# Altium schematic sheet as14120_power.SchDoc
size A3; PageSetup: Record=PageOptions|CenterHorizontal=True|CenterVertical=True|PrintScale=3.75|XCorrection=1.00|YCorrection=1.00|PrintKind=0|BorderSize=5000000|LeftOffset=0|BottomOffset=0|Orientation=2|PaperLength=1000|PaperWidth=1000|Scale=100|PaperSource=7|PrintQuality=-4|MediaType=1|DitherType=10|PaperKind=A4 (210 x 297 мм)|PrintScaleMode=1
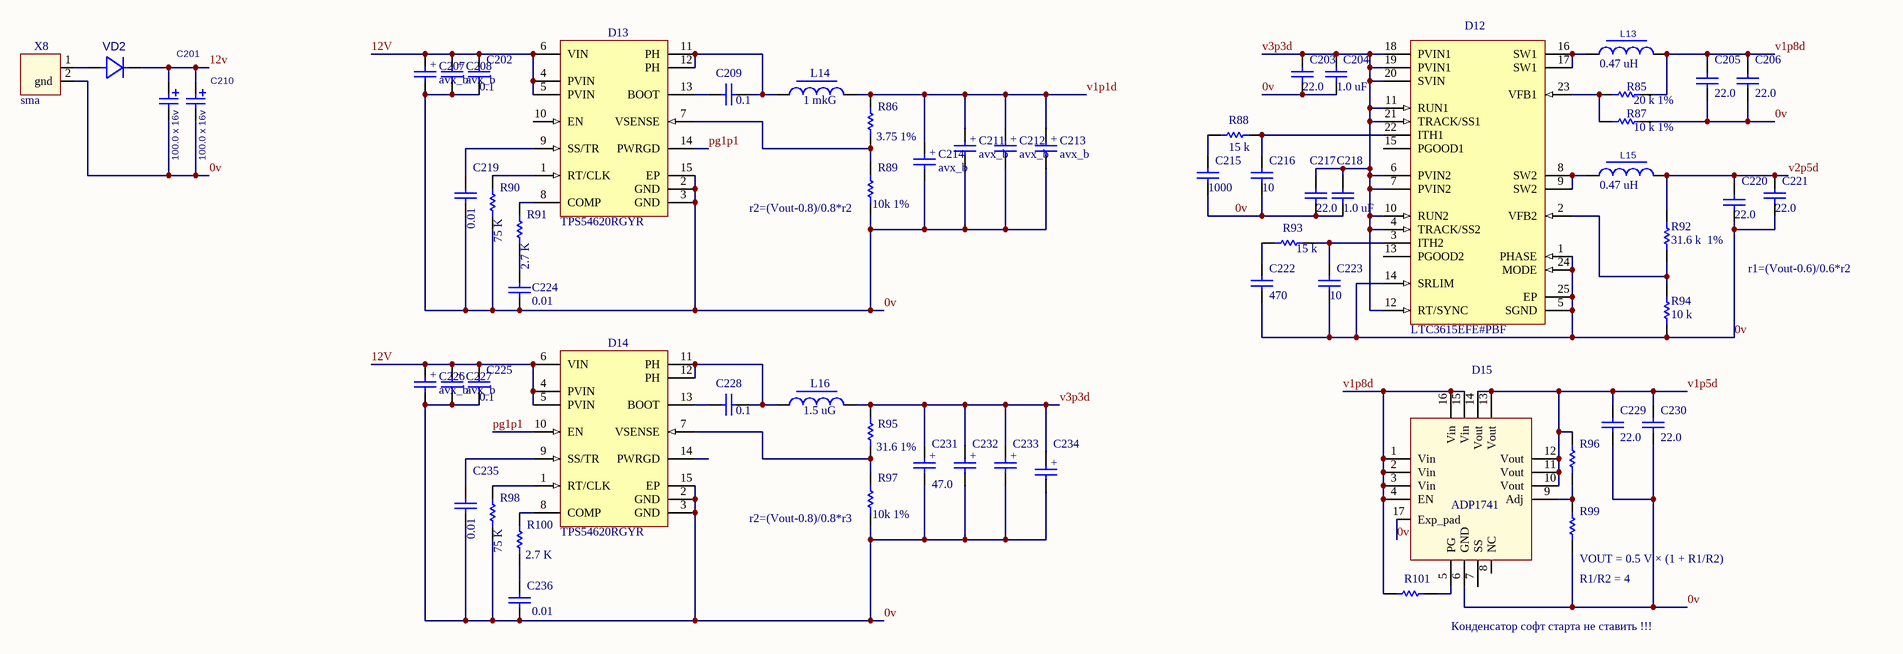
[diagram p0: as14120_power.SchDoc]

## Parts
C201  value 100.0 x 16v  [AVX_D]  (hidden comment: AVX_D)
C202  value 0.1  [CAPC0805(2012)100_N]  (hidden comment: CAP_0805)
C203  value 22.0  [CAPC0805(2012)100_N]  (hidden comment: CAP_0805)
C204  value 1.0 uF  [CAPC0805(2012)100_N]  (hidden comment: CAP_0805)
C205  value 22.0  [CAPC0805(2012)100_N]  (hidden comment: CAP_0805)
C206  value 22.0  [CAPC0805(2012)100_N]  (hidden comment: CAP_0805)
C207  avx_b  [avx_b]
C208  avx_b  [avx_b]
C209  value 0.1  [CAPC0805(2012)100_N]  (hidden comment: CAP_0805)
C210  value 100.0 x 16v  [AVX_D]  (hidden comment: AVX_D)
C211  avx_b  [avx_b]
C212  avx_b  [avx_b]
C213  avx_b  [avx_b]
C214  avx_b  [avx_b]
C215  value 1000  [CAPC0805(2012)100_N]  (hidden comment: CAP_0805)
C216  value 10  [CAPC0805(2012)100_N]  (hidden comment: CAP_0805)
C217  value 22.0  [CAPC0805(2012)100_N]  (hidden comment: CAP_0805)
C218  value 1.0 uF  [CAPC0805(2012)100_N]  (hidden comment: CAP_0805)
C219  value 0.01  [CAPC0805(2012)100_N]  (hidden comment: CAP_0805)
C220  value 22.0  [CAPC0805(2012)100_N]  (hidden comment: CAP_0805)
C221  value 22.0  [CAPC0805(2012)100_N]  (hidden comment: CAP_0805)
C222  value 470  [CAPC0805(2012)100_N]  (hidden comment: CAP_0805)
C223  value 10  [CAPC0805(2012)100_N]  (hidden comment: CAP_0805)
C224  value 0.01  [CAPC0805(2012)100_N]  (hidden comment: CAP_0805)
C225  value 0.1  [CAPC0805(2012)100_N]  (hidden comment: CAP_0805)
C226  avx_b  [avx_b]
C227  avx_b  [avx_b]
C228  value 0.1  [CAPC0805(2012)100_N]  (hidden comment: CAP_0805)
C229  value 22.0  [CAPC0805(2012)100_N]  (hidden comment: CAP_0805)
C230  value 22.0  [CAPC0805(2012)100_N]  (hidden comment: CAP_0805)
C231  value 47.0  [avx_b]  (hidden comment: avx_b)
C232  avx_b  [avx_b]  (value not drawn)
C233  avx_b  [avx_b]  (value not drawn)
C234  avx_b  [avx_b]  (value not drawn)
C235  value 0.01  [CAPC0805(2012)100_N]  (hidden comment: CAP_0805)
C236  value 0.01  [CAPC0805(2012)100_N]  (hidden comment: CAP_0805)
D12  LTC3615EFE#PBF  [LT-FE-24-EPV-AA_N]
D13  TPS54620RGYR  [RGY14-2050X2050TP]
D14  TPS54620RGYR  [RGY14-2050X2050TP]
D15  ADP1741  [CP-16-4_N]
L13  value 0.47 uH  [IND_Sumida_CDRH3D16]  (hidden comment: IND_Sumida_CDRH3D16)
L14  value 1 mkG  [IND_CDR127_Sumida]  (hidden comment: ind_cdr127_sumida)
L15  value 0.47 uH  [IND_Sumida_CDRH3D16]  (hidden comment: IND_Sumida_CDRH3D16)
L16  value 1.5 uG  [IND_CDR127_Sumida]  (hidden comment: ind_cdr127_sumida)
R85  value 20 k 1%  [RESC0805(2012)_L]  (hidden comment: 1K 1% 0805(2012))
R86  value 3.75 1%  [RESC0805(2012)_L]  (hidden comment: 1K 1% 0805(2012))
R87  value 10 k 1%  [RESC0805(2012)_L]  (hidden comment: 1K 1% 0805(2012))
R88  value 15 k  [RESC0805(2012)_L]  (hidden comment: 1K 1% 0805(2012))
R89  value 10k 1%  [RESC0805(2012)_L]  (hidden comment: 1K 1% 0805(2012))
R90  value 75 K  [RESC0805(2012)_L]  (hidden comment: 1K 1% 0805(2012))
R91  value 2.7 K  [RESC0805(2012)_L]  (hidden comment: 1K 1% 0805(2012))
R92  value 31.6 k  1%  [RESC0805(2012)_L]  (hidden comment: 1K 1% 0805(2012))
R93  value 15 k  [RESC0805(2012)_L]  (hidden comment: 1K 1% 0805(2012))
R94  value 10 k  [RESC0805(2012)_L]  (hidden comment: 1K 1% 0805(2012))
R95  value 31.6 1%  [RESC0805(2012)_L]  (hidden comment: 1K 1% 0805(2012))
R96  1K 1% 0805(2012)  [RESC0805(2012)_L]  (value not drawn)
R97  value 10k 1%  [RESC0805(2012)_L]  (hidden comment: 1K 1% 0805(2012))
R98  value 75 K  [RESC0805(2012)_L]  (hidden comment: 1K 1% 0805(2012))
R99  1K 1% 0805(2012)  [RESC0805(2012)_L]  (value not drawn)
R100  value 2.7 K  [RESC0805(2012)_L]  (hidden comment: 1K 1% 0805(2012))
R101  1K 5% 0603(1608)  [RESC0603(1608)_L]  (value not drawn)
VD2  30BQ60  [SMC]  (value not drawn)
X8  sma  [sma]

## Nets
0v: C201.2 C202.2 C203.1 C204.1 C205.1 C206.1 C207.2 C208.2 C210.2 C211.2 C212.2 C213.2 C214.2 C215.1 C216.1 C217.1 C218.1 C219.1 C220.1 C221.1 C222.1 C223.1 C224.1 C225.2 C226.2 C227.2 C229.1 C230.1 C231.2 C232.2 C233.2 C234.2 C235.1 C236.1 D12.1(PHASE) D12.5(SGND) D12.14(SRLIM) D12.24(MODE) D12.25(EP) D13.2(GND) D13.3(GND) D13.15(EP) D14.2(GND) D14.3(GND) D14.15(EP) D15.6(GND) D15.17(Exp_pad) R87.2 R89.1 R90.2 R94.1 R97.1 R98.2 R99.1 X8.2(gnd)
12V: C201.1 C202.1 C207.1 C208.1 C210.1 C225.1 C226.1 C227.1 D13.4(PVIN) D13.5(PVIN) D13.6(VIN) D14.4(PVIN) D14.5(PVIN) D14.6(VIN) VD2.1
pg1p1: D13.14(PWRGD) D14.10(EN)
v1p1d: C211.1 C212.1 C213.1 C214.1 L14.2 R86.2
v1p5d: C229.2 C230.2 D15.10(Vout) D15.11(Vout) D15.12(Vout) D15.13(Vout) D15.14(Vout) R96.2
v1p8d: C205.2 C206.2 D15.1(Vin) D15.2(Vin) D15.3(Vin) D15.4(EN) D15.15(Vin) D15.16(Vin) L13.2 R85.2 R101.2
v2p5d: C220.2 C221.2 L15.2 R92.2
v3p3d: C203.2 C204.2 C217.2 C218.2 C231.1 C232.1 C233.1 C234.1 D12.4(TRACK/SS2) D12.6(PVIN2) D12.7(PVIN2) D12.10(RUN2) D12.11(RUN1) D12.12(RT/SYNC) D12.18(PVIN1) D12.19(PVIN1) D12.20(SVIN) D12.21(TRACK/SS1) L16.2 R95.2
NetC209_1: C209.1 D13.13(BOOT)
NetC209_2: C209.2 D13.11(PH) D13.12(PH) L14.1
NetC215_2: C215.2 R88.1
NetC216_2: C216.2 D12.22(ITH1) R88.2
NetC219_2: C219.2 D13.9(SS/TR)
NetC222_2: C222.2 R93.1
NetC223_2: C223.2 D12.3(ITH2) R93.2
NetC224_2: C224.2 R91.2
NetC228_1: C228.1 D14.13(BOOT)
NetC228_2: C228.2 D14.11(PH) D14.12(PH) L16.1
NetC235_2: C235.2 D14.9(SS/TR)
NetC236_2: C236.2 R100.2
NetD12_2: D12.2(VFB2) R92.1 R94.2
NetD12_8: D12.8(SW2) D12.9(SW2) L15.1
NetD12_16: D12.16(SW1) D12.17(SW1) L13.1
NetD12_23: D12.23(VFB1) R85.1 R87.1
NetD13_1: D13.1(RT/CLK) R90.1
NetD13_7: D13.7(VSENSE) R86.1 R89.2
NetD13_8: D13.8(COMP) R91.1
NetD14_1: D14.1(RT/CLK) R98.1
NetD14_7: D14.7(VSENSE) R95.1 R97.2
NetD14_8: D14.8(COMP) R100.1
NetD15_5: D15.5(PG) R101.1
NetD15_9: D15.9(Adj) R96.1 R99.2
NetVD2_2: VD2.2 X8.1

Not connected (* = marked no-connect by the designer): D12 13(PGOOD2) 15(PGOOD1); D13 10(EN); D14 14(PWRGD); D15 7(SS) 8(NC)

## Notes on the sheet
- (near R89) r2=(Vout-0.8)/0.8*r2
- r1=(Vout-0.6)/0.6*r2
- (near R97) r2=(Vout-0.8)/0.8*r3
- (near R99) VOUT = 0.5 V × (1 + R1/R2)
- R1/R2 = 4
- Конденсатор софт старта не ставить !!!
- Title
- Size:
- Date:
- A3
- Number:
- Time:
- Revision:
- Sheet
- of
- File:
- (in symbol avx_b) +

## Library data of the parts
D12 = LTC3615EFE#PBF: Dual 4 MHz, 3 A Synchronous Step-Down DC/DC Converter, 24-pin SOP (FE-24-EPV-AA), -40 to 125 degC, Pb-Free; Manufacturer: Linear Technology; Frequency Adjust Range: Up - 4MHz; Number of Outputs: 2; DatasheetVersion: Rev. B; PackageVersion: Rev. B, 09/2010; PackageReference: FE-24; PackageDescription: 24-Pin Plastic TSSOP, Body 7.8 x 4.4 mm, Pitch 0.65 mm; Supplier 1: Digi-Key; Supplier Part Number 1: LTC3615EFE#PBF-ND; Supplier 2: Farnell; Supplier Part Number 2: 1839098; RoHS: TRUE; Mounting Technology: Surface Mount; PartNumber: LTC3615EFE#PBF; ComponentLink1Description: Manufacturer URL; ComponentLink1URL: http://www.linear.com/; ComponentLink2Description: Datasheet; ComponentLink2URL: http://cds.linear.com/docs/en/datasheet/3615fb.pdf; ComponentLink3Description: Package Specification; ComponentLink3URL: http://cds.linear.com/docs/en/packaging/TSSOP_24_05-08-1771.pdf
D13 D14 = TPS54620RGYR: Buck Step Down Regulator with 4.5 to 17 V Input and 0.8 to 15 V Output, -40 to 150 degC, 14-Pin VQFN (RGY), Green (RoHS & no Sb/Br); Manufacturer: Texas Instruments; Duty Cycle(Max)(%): 98; Iout(Max)(A): 6; Iq(Typ)(mA): 0.6; Rating: Catalog; Regulated Outputs(#): 1; SubFamily: Step-Down Regulator; Switch Current Limit(Typ)(A): 8; Synchronous Rectification: TRUE; Vin(Max)(V): 17; Vin(Min)(V): 4.5; Vout(Max)(V): 15; Vout(Min)(V): 0.8; DatasheetVersion: SLVS949C; PackageVersion: revI, Jun-2011; PackageReference: RGY14-2050X2050TP; PackageDescription: 14-Leads Plastic Quad Flatpack No-Lead, 3.5 x 3.5 x 0.9 mm Body, 0.5 mm Pitch; Supplier 1: Digi-Key; Supplier Part Number 1: 296-24554-2-ND; Supplier 2: Digi-Key; Supplier Part Number 2: 296-24554-1-ND; Supplier 3: Digi-Key; Supplier Part Number 3: 296-24554-6-ND; Supplier 4: Newark; Supplier Part Number 4: 25R0106; Supplier 5: Mouser; Supplier Part Number 5: 595-TPS54620RGYR; Eco-Plan: Green (RoHS & no Sb/Br); Topology: Buck; Mounting Technology: Surface Mount; Code_JEDEC: MO-241-BA; PartNumber: TPS54620RGYR; ComponentLink1Description: Datasheet; ComponentLink1URL: http://www.ti.com/general/docs/lit/getliterature.tsp?genericPartNumber=TPS54620&fileType=pdf; ComponentLink2Description: Package Specification; ComponentLink2URL: http://www.ti.com/litv/pdf/mpqf114g; ComponentLink3Description: URL Link1; ComponentLink3URL: Samples URL:http://www.ti.com/product/tps54620#samples
L13 L15 = IND_Sumida_CDRH3D16: INDUCT
R85-R95 R97 R98 R100 = RES_0805: 1K 0.125W 1% 0805 (2012 Metric)  SMD; Case-Metric: 2012; Case-EIA: 0805; Tolerance: 1 %; Power: 0.125 W; Technology: SMT
R96 R99 = RES_0805: 1K 0.125W 1% 0805 (2012 Metric)  SMD; Case-Metric: 2012; Value: 1000.00 Ohm; Case-EIA: 0805; Tolerance: 1 %; Power: 0.125 W; Technology: SMT
R101 = RES_0603: 1K 0.1W 5% 0603 (1608 Metric)  SMD; Case-EIA: 0603; Case-Metric: 1608; Value: 1000.00 Ohm; Technology: SMT; Tolerance: 5 %; Power: 0.1 W
VD2 = 30BQ60: Value: {Value}